# Altium schematic sheet Low_Side_Switch.SchDoc: Edit Title in Document Parameters
size B; Address1: # and Street; Address2: City, State, Zip; Address3: Phone#; Address4: USA; DocumentNumber: 3; SheetNumber: 3; SheetTotal: 4; CompanyName: CompanyName; TemplateRev: D-PCD-0111-01
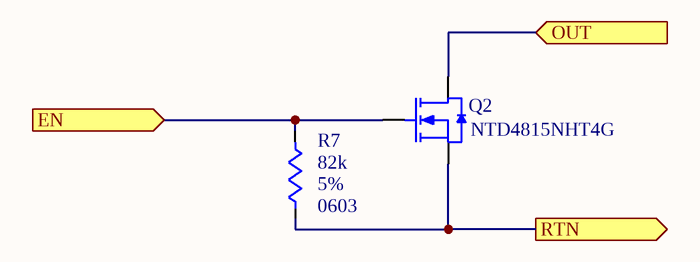
[diagram p0: Low_Side_Switch.SchDoc]

## Parts
Q2  Manufacturer Part Number 1: NTD4815NHT4G  [DPAK228P991X238-3N_NTD4815NHT4G]  (hidden comment: NFET_SOT323)
R7  value 82k  Tolerance: 5%  Package: 0603  [RESC1508X09N]  (hidden comment: RES)

## Ports
EN (in), OUT (in), RTN (out)

## Nets
EN: Q2.G R7.2 ; port EN
OUT: Q2.D ; port OUT
RTN: Q2.S R7.1 ; port RTN

## Notes on the sheet
- 4
- 3
- 2
- 1
- D
- C
- B
- 1455 Market St., Ste 600
- A
- San Francisco, CA 94103
- WWW.SQUAREUP.COM
- SIZE
- TITLE
- PRINT DATE
- DRAWING NO.
- REVISION
- RELEASE/EDITION
- © SQUARE INC
- PROPRIETARY AND CONFIDENTIAL.
- ALL RIGHTS RESERVED. NO DUPLICATION, USE OR
- DISCLOSURES WITHOUT PRIOR WRITTEN APPROVAL.
- JIRA EPIC
- SHEET            OF

## Library data of the parts
Q2 = NMOS-0002: MOSFET N-CH 30V 6.9A/35A DPAK; Manufacturer 1: onsemi; Type: NFET; Current - Max Continuous: 6.9A; Gate Charge (Qg) (Max) @ Vgs: 6.8 nC @ 4.5 V; Vgs (Max): 20V; Rds On (Max) @ Id, Vgs: 15mOhm @ 30A, 10V; Vgs(th) (Max) @ Id: 2.5V @ 250µA; Drive Voltage (Max Rds On, Min Rds On): 4.5V, 11.5V; TPN: NMOS-0002; Supplier 1: Digi-Key; Supplier Part Number 1: NTD4815NHT4GOSCT-ND; Drain to Source Voltage (Vdss): 30V; Gate Charge (Qg) @ Vgs: 6.8 nC @ 4.5 V; Operating Temperature: -55°C ~ 175°C (TJ); Package / Case: TO-252-3, DPak (2 Leads + Tab), SC-63; ComponentLink1URL: https://www.onsemi.com/pdf/datasheet/ntd4815nh-d.pdf; ComponentLink1Description: Datasheet; ComponentLink2URL: https://www.digikey.com/en/products/detail/onsemi/NTD4815NHT4G/1792971; ComponentLink2Description: Supplier Link
R7 = RES-SM-0288: RES 82K OHM 5% 0603; Power Rating: 0.125; Pulse-Rated: No; TPN: RES-SM-0288